# Altium schematic sheet Power.SchDoc
size Letter; Organization: Altium Limited; Address1: L3, 12a Rodborough Rd; Address2: Frenchs Forest; Address3: NSW; Address4: Australia 2086
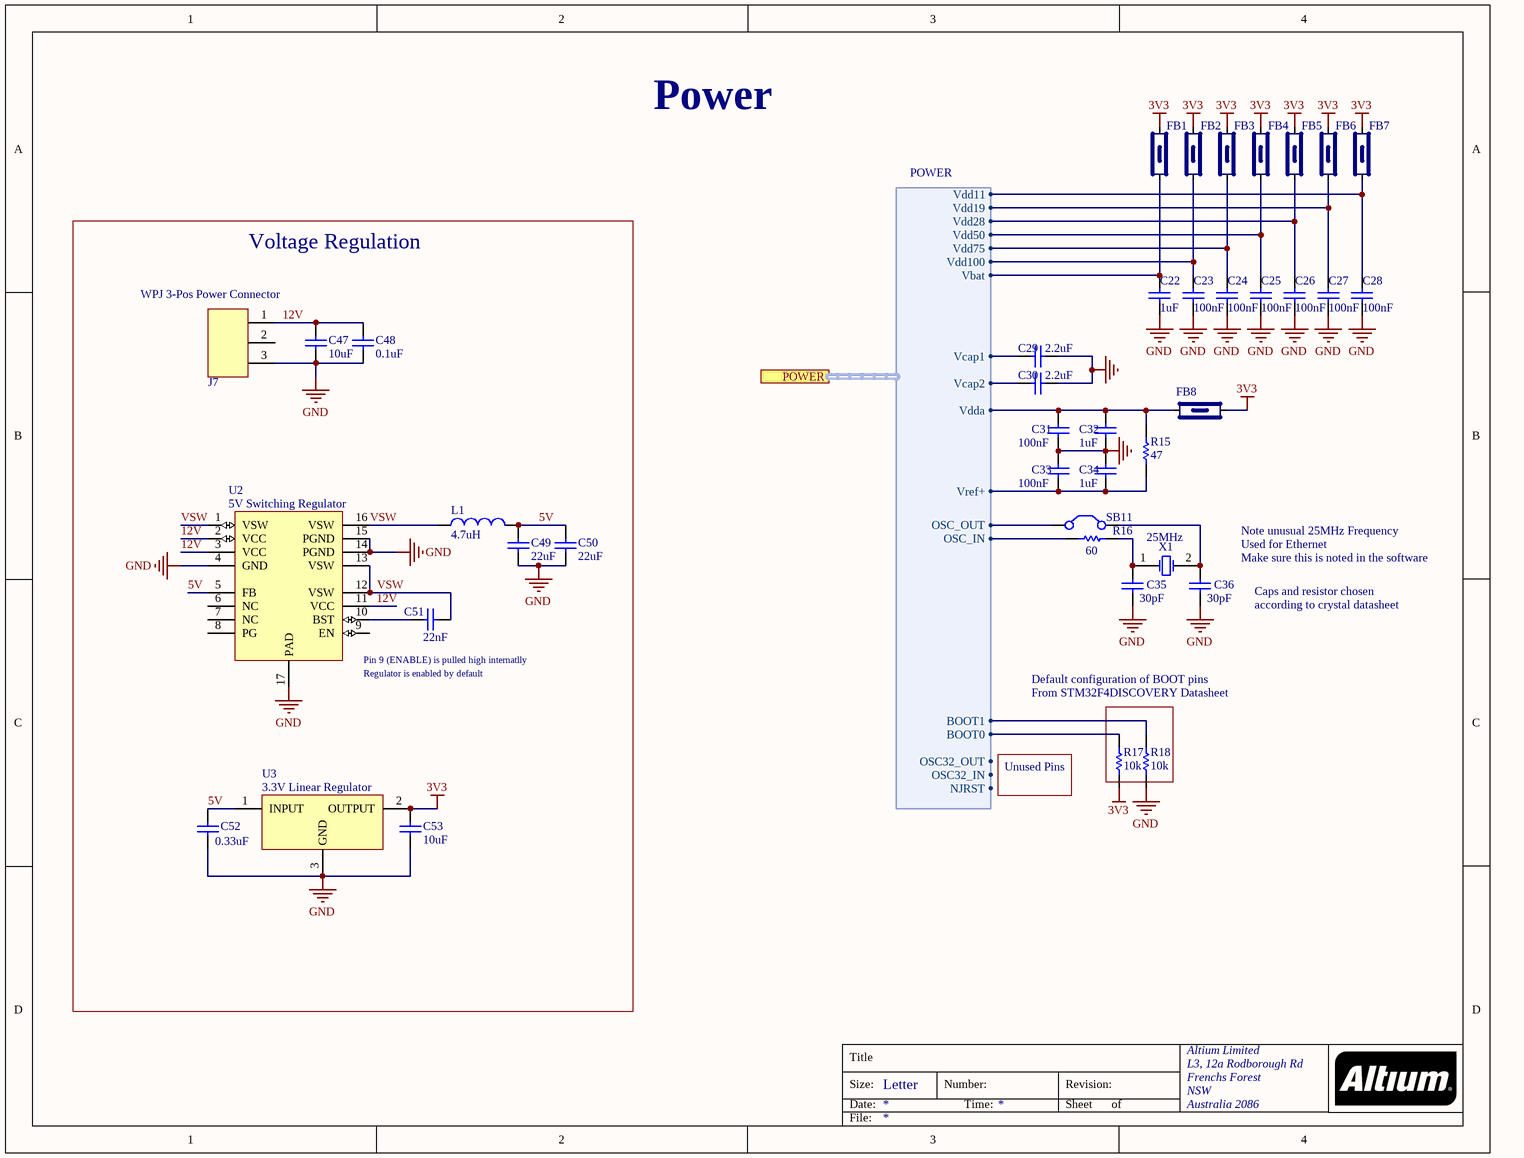
[diagram p0: Power.SchDoc]

## Parts
C22  value 1uF  [0402]
C23  value 100nF  [0402]
C24  value 100nF  [0402]
C25  value 100nF  [0402]
C26  value 100nF  [0402]
C27  value 100nF  [0402]
C28  value 100nF  [0402]
C29  value 2.2uF  [0402]
C30  value 2.2uF  [0402]
C31  value 100nF  [0402]
C32  value 1uF  [0402]
C33  value 100nF  [0402]
C34  value 1uF  [0402]
C35  value 30pF  [0402]
C36  value 30pF  [0402]
C47  value 10uF  [0402]  (hidden comment: Cap)
C48  value 0.1uF  [0402]  (hidden comment: Cap)
C49  value 22uF  [0402]  (hidden comment: Cap)
C50  value 22uF  [0402]  (hidden comment: Cap)
C51  value 22nF  [0402]  (hidden comment: Cap)
C52  value 0.33uF  [0402]  (hidden comment: Cap)
C53  value 10uF  [0402]  (hidden comment: Cap)
FB1  Ferrite Bead  [0402]  (value not drawn)
FB2  Ferrite Bead  [0402]  (value not drawn)
FB3  Ferrite Bead  [0402]  (value not drawn)
FB4  Ferrite Bead  [0402]  (value not drawn)
FB5  Ferrite Bead  [0402]  (value not drawn)
FB6  Ferrite Bead  [0402]  (value not drawn)
FB7  Ferrite Bead  [0402]  (value not drawn)
FB8  Ferrite Bead  [0402]  (value not drawn)
J7  WPJ 3-Pos Power Connector  [WPJ-3Pos]
L1  value 4.7uH  [Inductor]  (hidden comment: Inductor)
R15  value 47  [0402]  (hidden comment: Res1)
R16  value 60  [0402]  (hidden comment: Res1)
R17  value 10k  [0402]  (hidden comment: Res1)
R18  value 10k  [0402]  (hidden comment: Res1)
SB11  Jumper  [SB-2pos]  (value not drawn)
U2  5V Switching Regulator  [VQFN16]
U3  3.3V Linear Regulator  [DPAK]
X1  Frequency: 25MHz  [4SMD 25MHZ CRYSTAL]  (hidden comment: XTAL)

## Blocks framed on the sheet
Voltage Regulation: C47-C53 J7 L1 U2 U3

## Ports
POWER (harness POWER)

## Harnesses
POWER: BOOT0, BOOT1, NJRST, OSC_IN, OSC_OUT, OSC32_IN, OSC32_OUT, Vbat, Vcap1, Vcap2, Vdd100, Vdd11, Vdd19, Vdd28, Vdd50, Vdd75, Vdda, Vref+

## Nets
3V3: C53.1 FB1.2 FB2.2 FB3.2 FB4.2 FB5.2 FB6.2 FB7.2 FB8.2 R17.1 U3.2(OUTPUT)
GND: C22.1 C23.1 C24.1 C25.1 C26.1 C27.1 C28.1 C29.1 C30.1 C31.1 C32.1 C33.2 C34.2 C35.1 C36.1 C47.1 C48.1 C49.2 C50.2 C52.2 C53.2 J7.3 R18.1 U2.4(GND) U2.14(PGND) U2.15(PGND) U2.17(PAD) U3.3(GND)
5V: C49.1 C50.1 C52.1 L1.2 U2.5(FB) U3.1(INPUT)
12V: C47.2 C48.2 J7.1 U2.2(VCC) U2.3(VCC) U2.11(VCC)
VSW: C51.1 L1.1 U2.1(VSW) U2.12(VSW) U2.13(VSW) U2.16(VSW)
NetC22_2: C22.2 FB1.1 ; port POWER.Vbat
NetC23_2: C23.2 FB2.1 ; port POWER.Vdd100
NetC24_2: C24.2 FB3.1 ; port POWER.Vdd75
NetC25_2: C25.2 FB4.1 ; port POWER.Vdd50
NetC26_2: C26.2 FB5.1 ; port POWER.Vdd28
NetC27_2: C27.2 FB6.1 ; port POWER.Vdd19
NetC28_2: C28.2 FB7.1 ; port POWER.Vdd11
NetC29_2: C29.2 ; port POWER.Vcap1
NetC30_2: C30.2 ; port POWER.Vcap2
NetC31_2: C31.2 C32.2 FB8.1 R15.2 ; port POWER.Vdda
NetC33_1: C33.1 C34.1 R15.1 ; port POWER.Vref+
NetC35_2: C35.2 R16.1 X1.1(OSC1)
NetC36_2: C36.2 SB11.2(C2) X1.2(OSC2)
NetC51_2: C51.2 U2.10(BST)
NetR16_2: R16.2 ; port POWER.OSC_IN
NetR17_2: R17.2 ; port POWER.BOOT0
NetR18_2: R18.2 ; port POWER.BOOT1
NetSB11_1: SB11.1(C1) ; port POWER.OSC_OUT

Not connected (* = marked no-connect by the designer): J7 2; U2 6(NC) 7(NC) 8(PG) 9(EN)

## Notes on the sheet
- Power
- Note unusual 25MHz Frequency
- Used for Ethernet
- Make sure this is noted in the software
- Caps and resistor chosen
- according to crystal datasheet
- (near U2) Pin 9 (ENABLE) is pulled high internatlly
- (near U2) Regulator is enabled by default
- Default configuration of BOOT pins
- From STM32F4DISCOVERY Datasheet
- Unused Pins
- Title
- Size:
- Date:
- Letter
- Number:
- Time:
- Revision:
- Sheet
- of
- File:

## Library data of the parts
C22-C36 C47-C53 = Cap: Capacitor
  C47 C48: Published: 8-Jun-2000; LatestRevisionDate: 17-Jul-2002; LatestRevisionNote: Re-released for DXP Platform.; PackageReference: RAD-0.3; Publisher: Altium Limited; PackageDescription: Radial Cap, Thru-Hole; 2 Leads; 0.3 in Pin Spacing
J7 = WPJ 3-Pos Power Connector: Manufacturer PN: B03B-WPJSS-1(LF)(SN); DigiKey PN: 455-2448-ND
R15-R18 = Res1: Resistor
SB11 = Jumper: Jumper Wire
X1 = XTAL: Crystal Oscillator; Mnf Part No: FL2500316Z; DigiKey Part Number: FL2500316ZTR-ND
L1 = Inductor: DigiKey PN: 587-2100-1-ND
U2 = 5V Switching Regulator: DigiKey PN: TS30011-M050QFNRCT-ND
U3 = 3.3V Linear Regulator: DigiKey PN: 497-1496-1-ND